# EAGLE design ESC-combined (EAGLE 9.6.2)
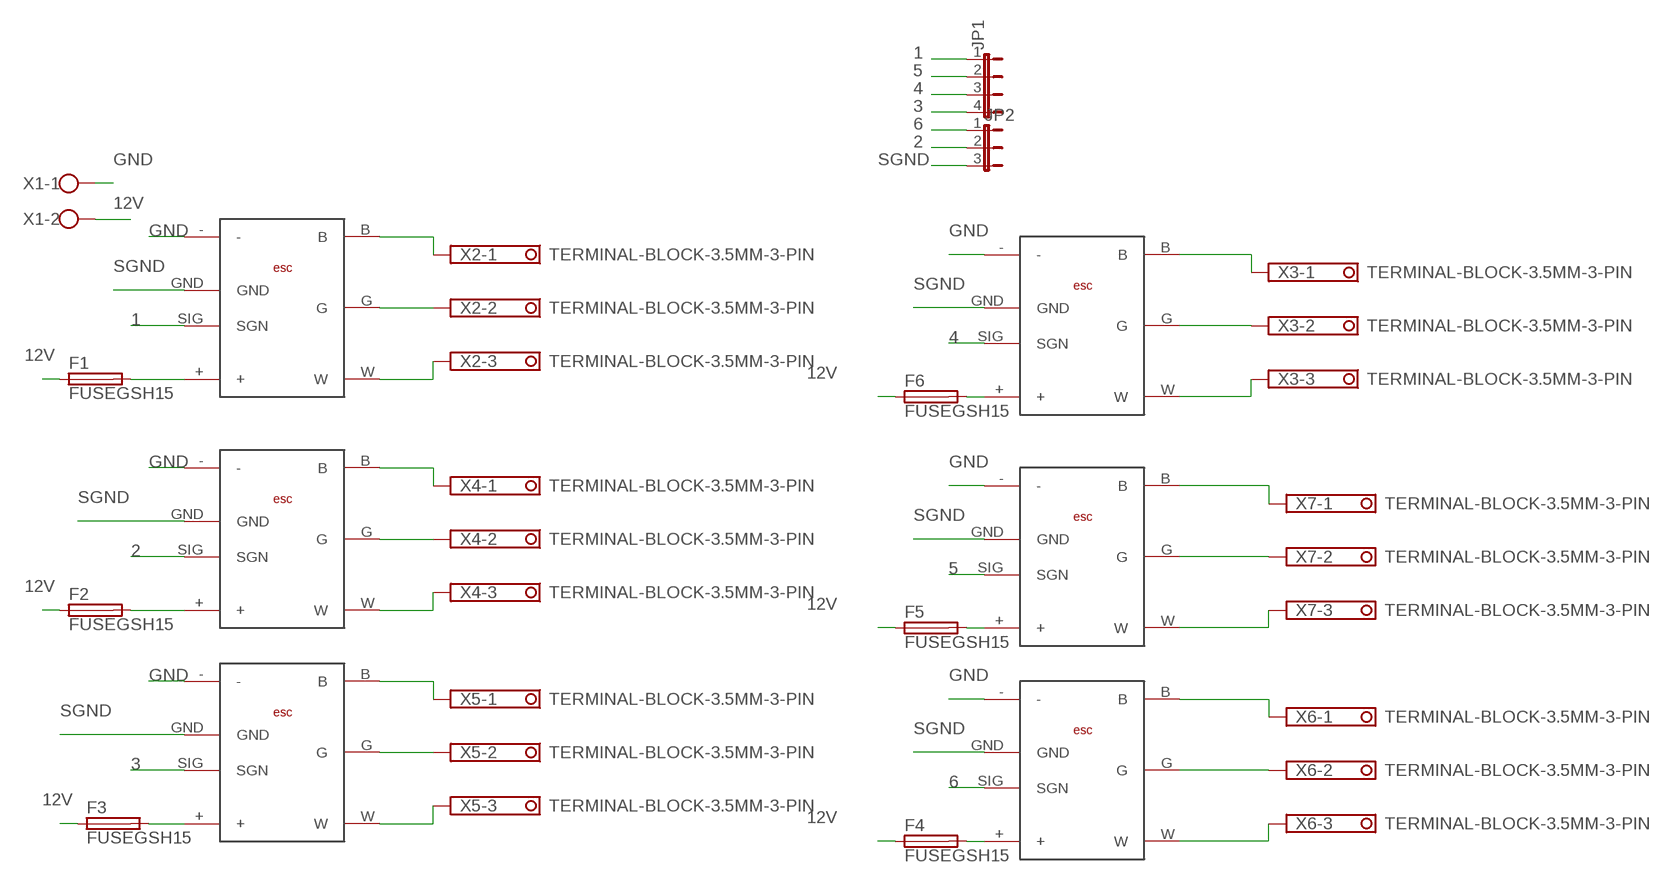
[diagram p0: schematic, sheet 1]

## Parts
F1  FUSEGSH15  [GSH15]
F2  FUSEGSH15  [GSH15]
F3  FUSEGSH15  [GSH15]
F4  FUSEGSH15  [GSH15]
F5  FUSEGSH15  [GSH15]
F6  FUSEGSH15  [GSH15]
JP1  JP4E  [JP4]
JP2  JP2E  [JP2]
U$1  ESCV!  [ESCV!]
U$2  ESCV!  [ESCV!]
U$3  ESCV!  [ESCV!]
U$4  ESCV!  [ESCV!]
U$5  ESCV!  [ESCV!]
U$6  ESCV!  [ESCV!]
X1  12V  W237-102  [W237-102]
X2  TERMINAL-BLOCK-3.5MM-3-PIN  [HDRV3W150P950_1X3_3150X1470X1860A]
X3  TERMINAL-BLOCK-3.5MM-3-PIN  [HDRV3W150P950_1X3_3150X1470X1860A]
X4  TERMINAL-BLOCK-3.5MM-3-PIN  [HDRV3W150P950_1X3_3150X1470X1860A]
X5  TERMINAL-BLOCK-3.5MM-3-PIN  [HDRV3W150P950_1X3_3150X1470X1860A]
X6  TERMINAL-BLOCK-3.5MM-3-PIN  [HDRV3W150P950_1X3_3150X1470X1860A]
X7  TERMINAL-BLOCK-3.5MM-3-PIN  [HDRV3W150P950_1X3_3150X1470X1860A]

## Nets
1: JP1.1 U$1.SIG(SGN)
2: JP2.2 U$2.SIG(SGN)
3: JP1.4 U$3.SIG(SGN)
4: JP1.3 U$4.SIG(SGN)
5: JP1.2 U$5.SIG(SGN)
6: JP2.1 U$6.SIG(SGN)
12V: F1.1 F2.1 F3.1 F4.1 F5.1 F6.1 X1.2
GND: U$1.- U$2.- U$3.- U$4.- U$5.- U$6.- X1.1
N$1: F6.2 U$4.+
N$2: F1.2 U$1.+
N$3: F2.2 U$2.+
N$4: F3.2 U$3.+
N$5: F5.2 U$5.+
N$6: F4.2 U$6.+
N$7: U$1.B X2.1
N$8: U$1.G X2.2
N$9: U$1.W X2.3
N$10: U$2.B X4.1
N$11: U$2.G X4.2
N$12: U$2.W X4.3
N$13: U$3.B X5.1
N$14: U$3.G X5.2
N$15: U$3.W X5.3
N$16: U$6.B X6.1
N$17: U$6.G X6.2
N$18: U$6.W X6.3
N$19: U$5.B X7.1
N$20: U$5.G X7.2
N$21: U$5.W X7.3
N$22: U$4.B X3.1
N$23: U$4.G X3.2
N$24: U$4.W X3.3
SGND: JP2.3 U$1.GND U$2.GND U$3.GND U$4.GND U$5.GND U$6.GND

## Library data of the parts
F1-F6 = fuse:FUSE: Fuse; OC_FARNELL: unknown; OC_NEWARK: unknown
JP1 = jumper:JP4E: JUMPER
JP2 = jumper:JP2E: JUMPER
U$1-U$6 = untitled:ESCV!
X1 = con-wago-500:W237-102: WAGO SCREW CLAMP; MPN: 237-102; OC_FARNELL: unknown; OC_NEWARK: 70K9898
X2-X7 = 3pin:TERMINAL-BLOCK-3.5MM-3-PIN: Terminal Block 3.5mm Pitch: 3,5 mm Number of pins: 3 Created by Rembrandt Electronics www.rembrandtelectronics.com

## Board
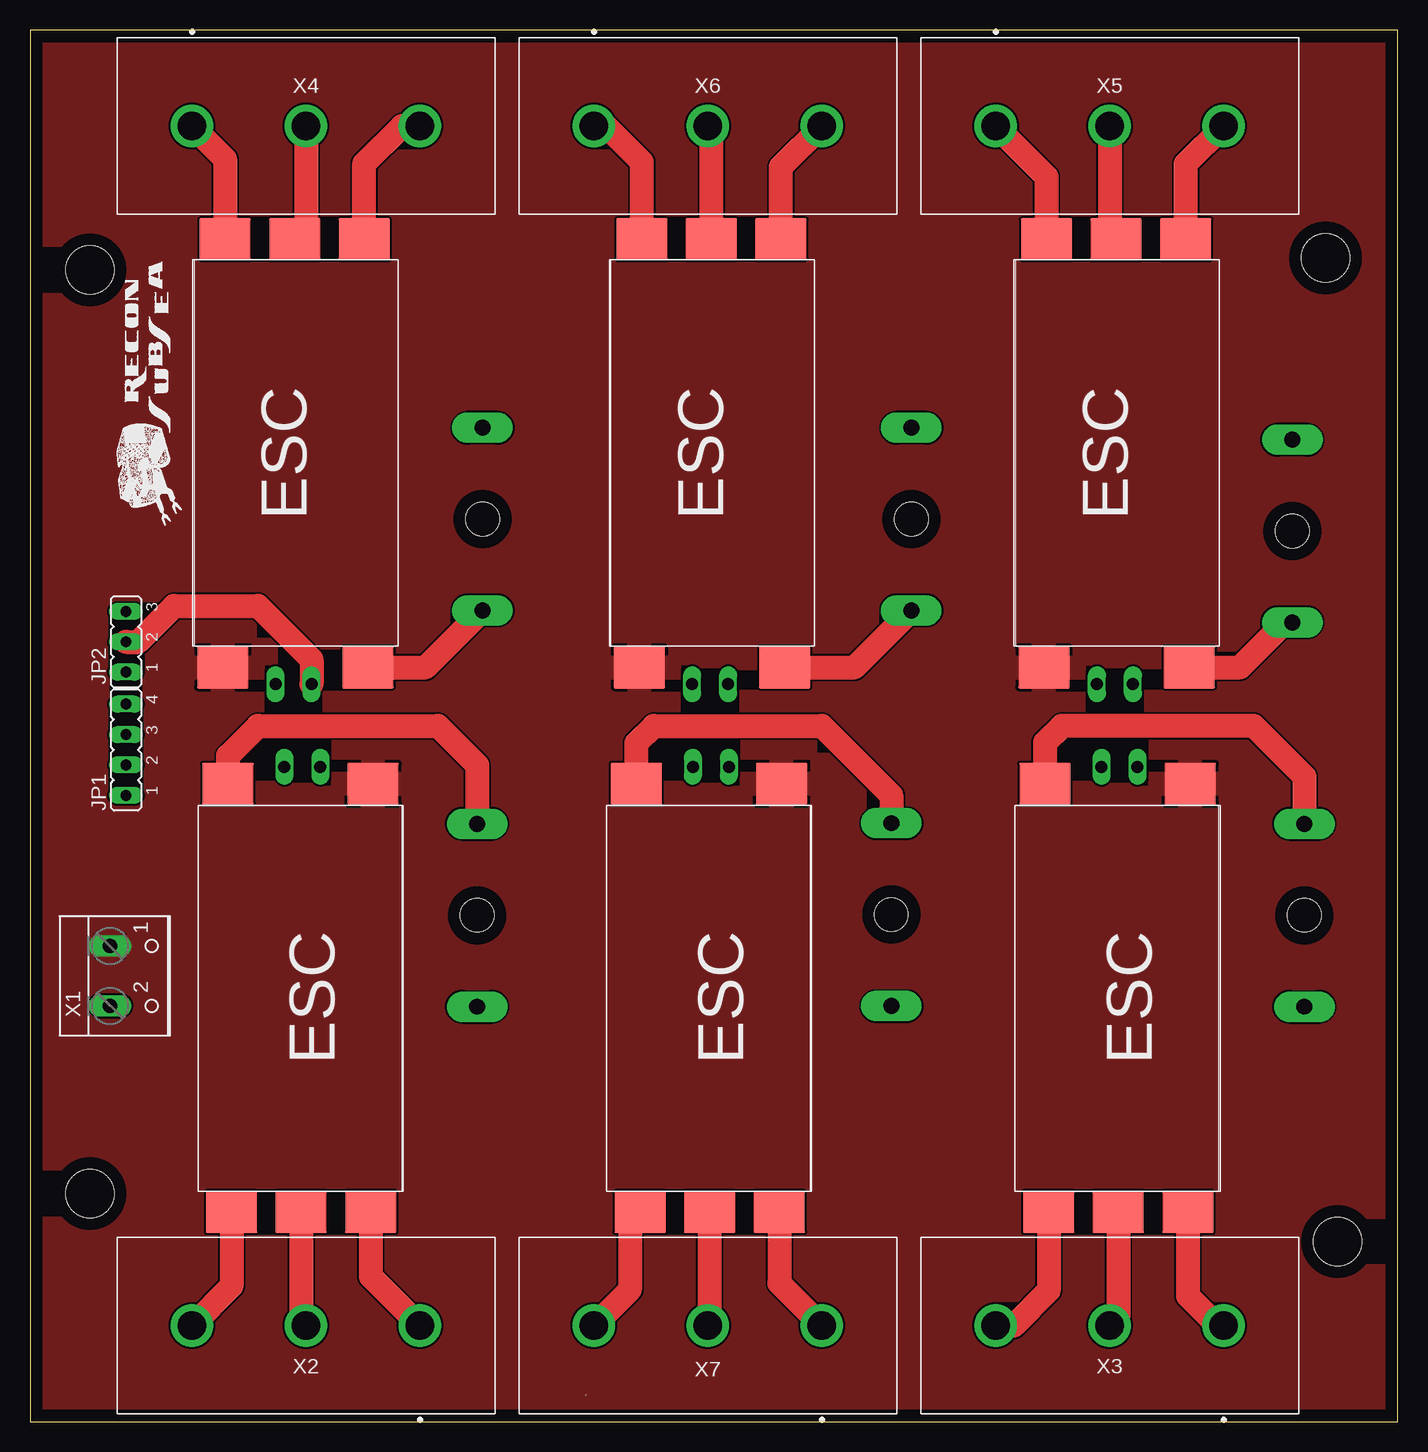
[diagram p1: board, top side]
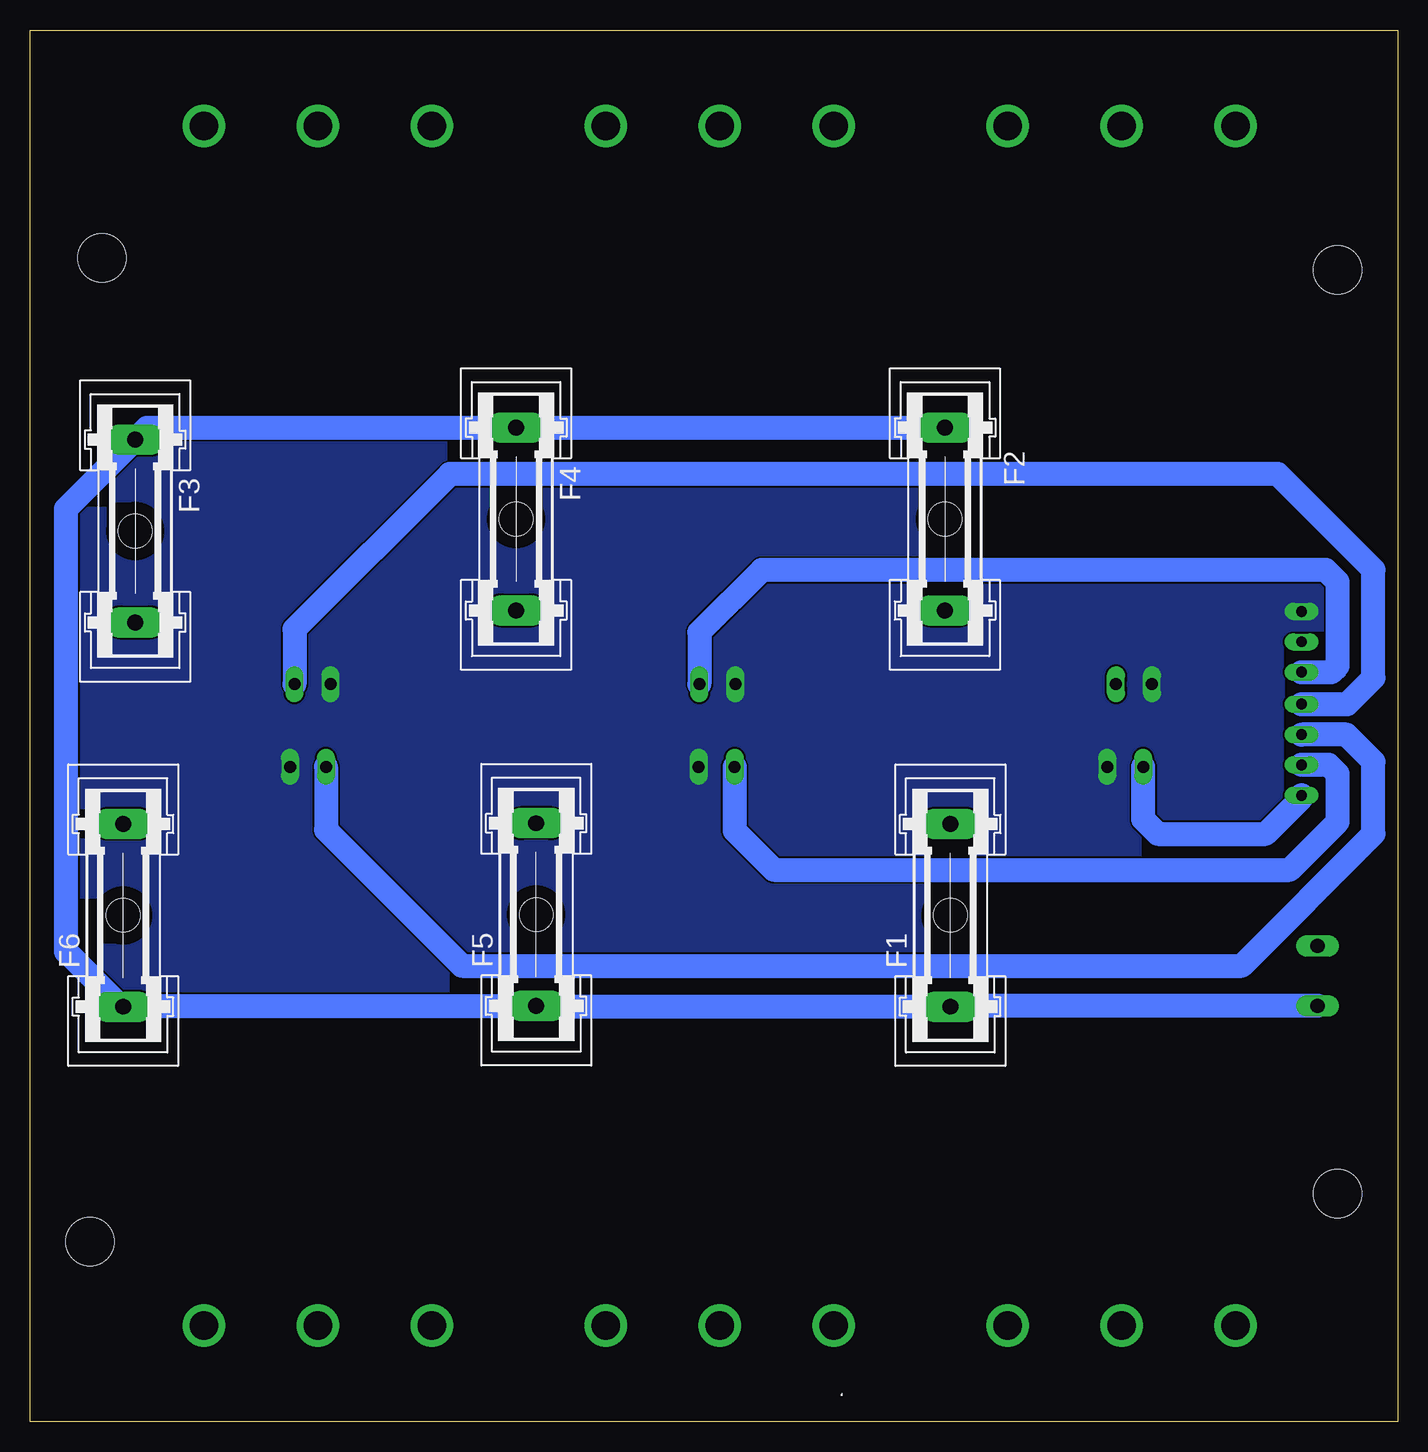
[diagram p2: board, bottom side, seen from below]

Size 114 x 116 mm. Coordinates in mm from the lower left corner, seen from the top.
Outline: 0,116 0,0 114,0 114,116 0,116
Copper layers (1*16): Top 0.035mm / dielectric 1.5mm / Bottom 0.035mm
Design rules "default": minimum track width 6mil, minimum drill 0.35mm, track to track 6mil, track to pad 6mil, pad to pad 6mil, via to via 6mil, smd to smd 6mil, copper to edge 40mil, drill to drill 6mil, minimum pad ring 10mil, minimum via ring 8mil, stop-mask expansion 4mil, vias tented up to drill 0mil, thermal gap 10mil
Holes 4 mm at 5,19 109,15 108,97 5,96

### Footprints (pad centres in the part's own frame; a part is rotated, then mirrored left to right if it is on the bottom)
GSH15 = drill 1.321 pad 2.54 long: 1 -7.62,0; 2 7.62,0 | hole 2.794: 0,0
JP4 = drill 0.914 long: 1 -3.81,0; 2 -1.27,0; 3 1.27,0; 4 3.81,0
JP2 = drill 0.914 long: 1 -2.54,0; 2 0,0; 3 2.54,0
ESCV! = smd 3.5 x 4.3: + -1.8,2.5; - -1.8,14.6; B 33.9,14.4; G 33.9,8.6; W 33.9,2.8 | drill 1 long: GND -3.2,10.2; SIG -3.2,7.2
W237-102 = drill 1.194 long: 1 -2.5,-1.27; 2 2.5,-1.27
HDRV3W150P950_1X3_3150X1470X1860A = drill 2.371 pad 3.557: 1 -9.5,0; 2 0,0; 3 9.5,0

### Placement (x,y rotation side)
F1  37.28,42.2 90 bottom
F2  37.72,75.23 270 bottom
F3  105.23,74.23 270 bottom
F4  73.48,75.23 270 bottom
F5  71.8,42.26 90 bottom
F6  106.23,42.2 90 bottom
JP1  8,56 90 top
JP2  8,65 90 top
U$1  14,51.37 270 top
U$2  30.67,64.66 90 top
U$3  99.14,64.66 90 top
U$4  82.12,51.37 270 top
U$5  48.06,51.37 270 top
U$6  65.4,64.66 90 top
X1  7.94,37.15 270 top
X2  23,8 180 top
X3  90,8 180 top
X4  23,108 0 top
X5  90,108 0 top
X6  56.5,108 0 top
X7  56.5,8 180 top

### Tracks (layer width: path | path; a pad name or v marks a point on that pad's centre or on a via)
1
  Bottom 2: JP1.1 8,52 11,49 20,49 21.2,50.2 U$1.SIG
2
  Top 2: JP2.2 9,65 12,68 19,68 23.47,63.53 U$2.SIG
3
  Bottom 2: JP1.4 4.19,59.81 2.02,61.98 2.02,71.02 10,79 79,79 91.94,66.06 U$3.SIG
4
  Bottom 2: U$4.SIG 89.32,49.32 78,38 13,38 2.02,48.98 2.02,55.02 4.27,57.27 JP1.3
5
  Bottom 2: U$5.SIG 55.26,49.26 52,46 9,46 5,50 5,54 5.73,54.73 JP1.2
6
  Bottom 2: JP2.1 5.54,62.46 5,63 5,70 6,71 53,71 58.2,65.8 U$6.SIG
12V
  Bottom 2: X1.2 37.21,34.65 F1.1 71.74,34.58 F5.1 106.18,34.64 F6.1 | F6.1 106.28,34.58 106.3,34.6 | F2.1 F4.1 104.24,82.85 F3.1 111,76.08 111,39.17 106.41,34.58 F6.1
GND
  pour Top: -5.1,119 -5.1,-4.31 119,-4.31 119,119
N$1
  Top 2: F6.2 106.24,53.76 102,58 86,58 84.62,56.62 U$4.+
N$2
  Top 2: U$1.+ 16.5,55.5 19,58 34,58 37.28,54.72 F1.2
N$3
  Top 2: U$2.+ 32.97,62.86 F2.2
N$4
  Top 2: U$3.+ 100.86,62.86 104.61,66.61 F3.2
N$5
  Top 2: U$5.+ 50.56,56.56 52,58 66,58 71.8,52.2 F5.2
N$6
  Top 2: U$6.+ 68.73,62.86 F4.2
N$7
  Top 2: U$1.B 28.4,12.1 X2.1
N$8
  Top 2: U$1.G 22.6,8.4 X2.2
N$9
  Top 2: U$1.W 16.8,11.3 X2.3
N$10
  Top 2: X4.1 16.27,105.23 U$2.B
N$11
  Top 2: X4.2 23,99.49 U$2.G
N$12
  Top 2: U$2.W 27.87,104.87 31,108 X4.3
N$13
  Top 2: X5.1 84.74,103.76 U$3.B
N$14
  Top 2: X5.2 90,99.1 U$3.G
N$15
  Top 2: U$3.W 96.34,104.84 X5.3
N$16
  Top 2: U$6.B 51,105 48,108 X6.1
N$17
  Top 2: U$6.G 56.8,107.7 X6.2
N$18
  Top 2: X6.3 62.6,104.6 U$6.W
N$19
  Top 2: U$5.B 62.46,11.54 X7.1
N$20
  Top 2: U$5.G 56.66,8.16 X7.2
N$21
  Top 2: U$5.W 50,16.61 50,11 X7.3
N$22
  Top 2: X3.1 99,8 96.52,10.48 U$4.B
N$23
  Top 2: U$4.G 90.72,8.72 X3.2
N$24
  Top 2: U$4.W 84.92,10.92 82,8 X3.3
SGND
  pour Bottom: -2.48,117 -2.48,-1.3 116,-1.3 116,117

### Text on the board
tPlace: C:/Users/RAKSHIT/Downloads/WhatsApp Image 2021-01-09 at 20.18.38 (2).bmp